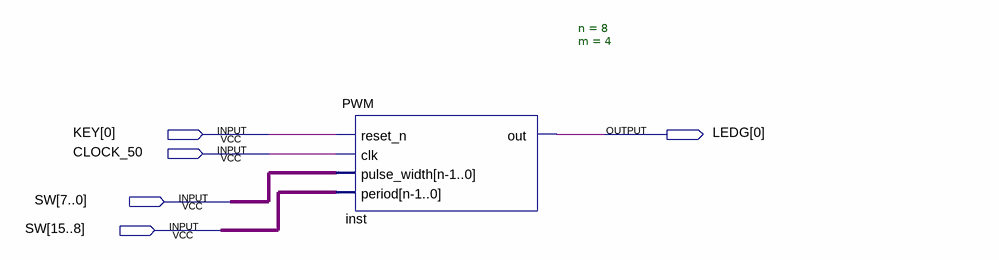
[diagram p0: schematic sheet]
// Quartus schematic pwm_test.bdf as structural Verilog: 1 symbols, 5 pins
module pwm_test (
  input  [0:0] KEY,
  input  CLOCK_50,
  input  [15:0] SW,
  output [0:0] LEDG
);

  PWM #(.n(8), .m(4)) inst (.reset_n(KEY[0]), .clk(CLOCK_50), .pulse_width(SW[7:0]), .period(SW[15:8]), .out(LEDG[0]));
endmodule
